# EAGLE design tiva-neural-signal-evk (EAGLE 6.6.0)
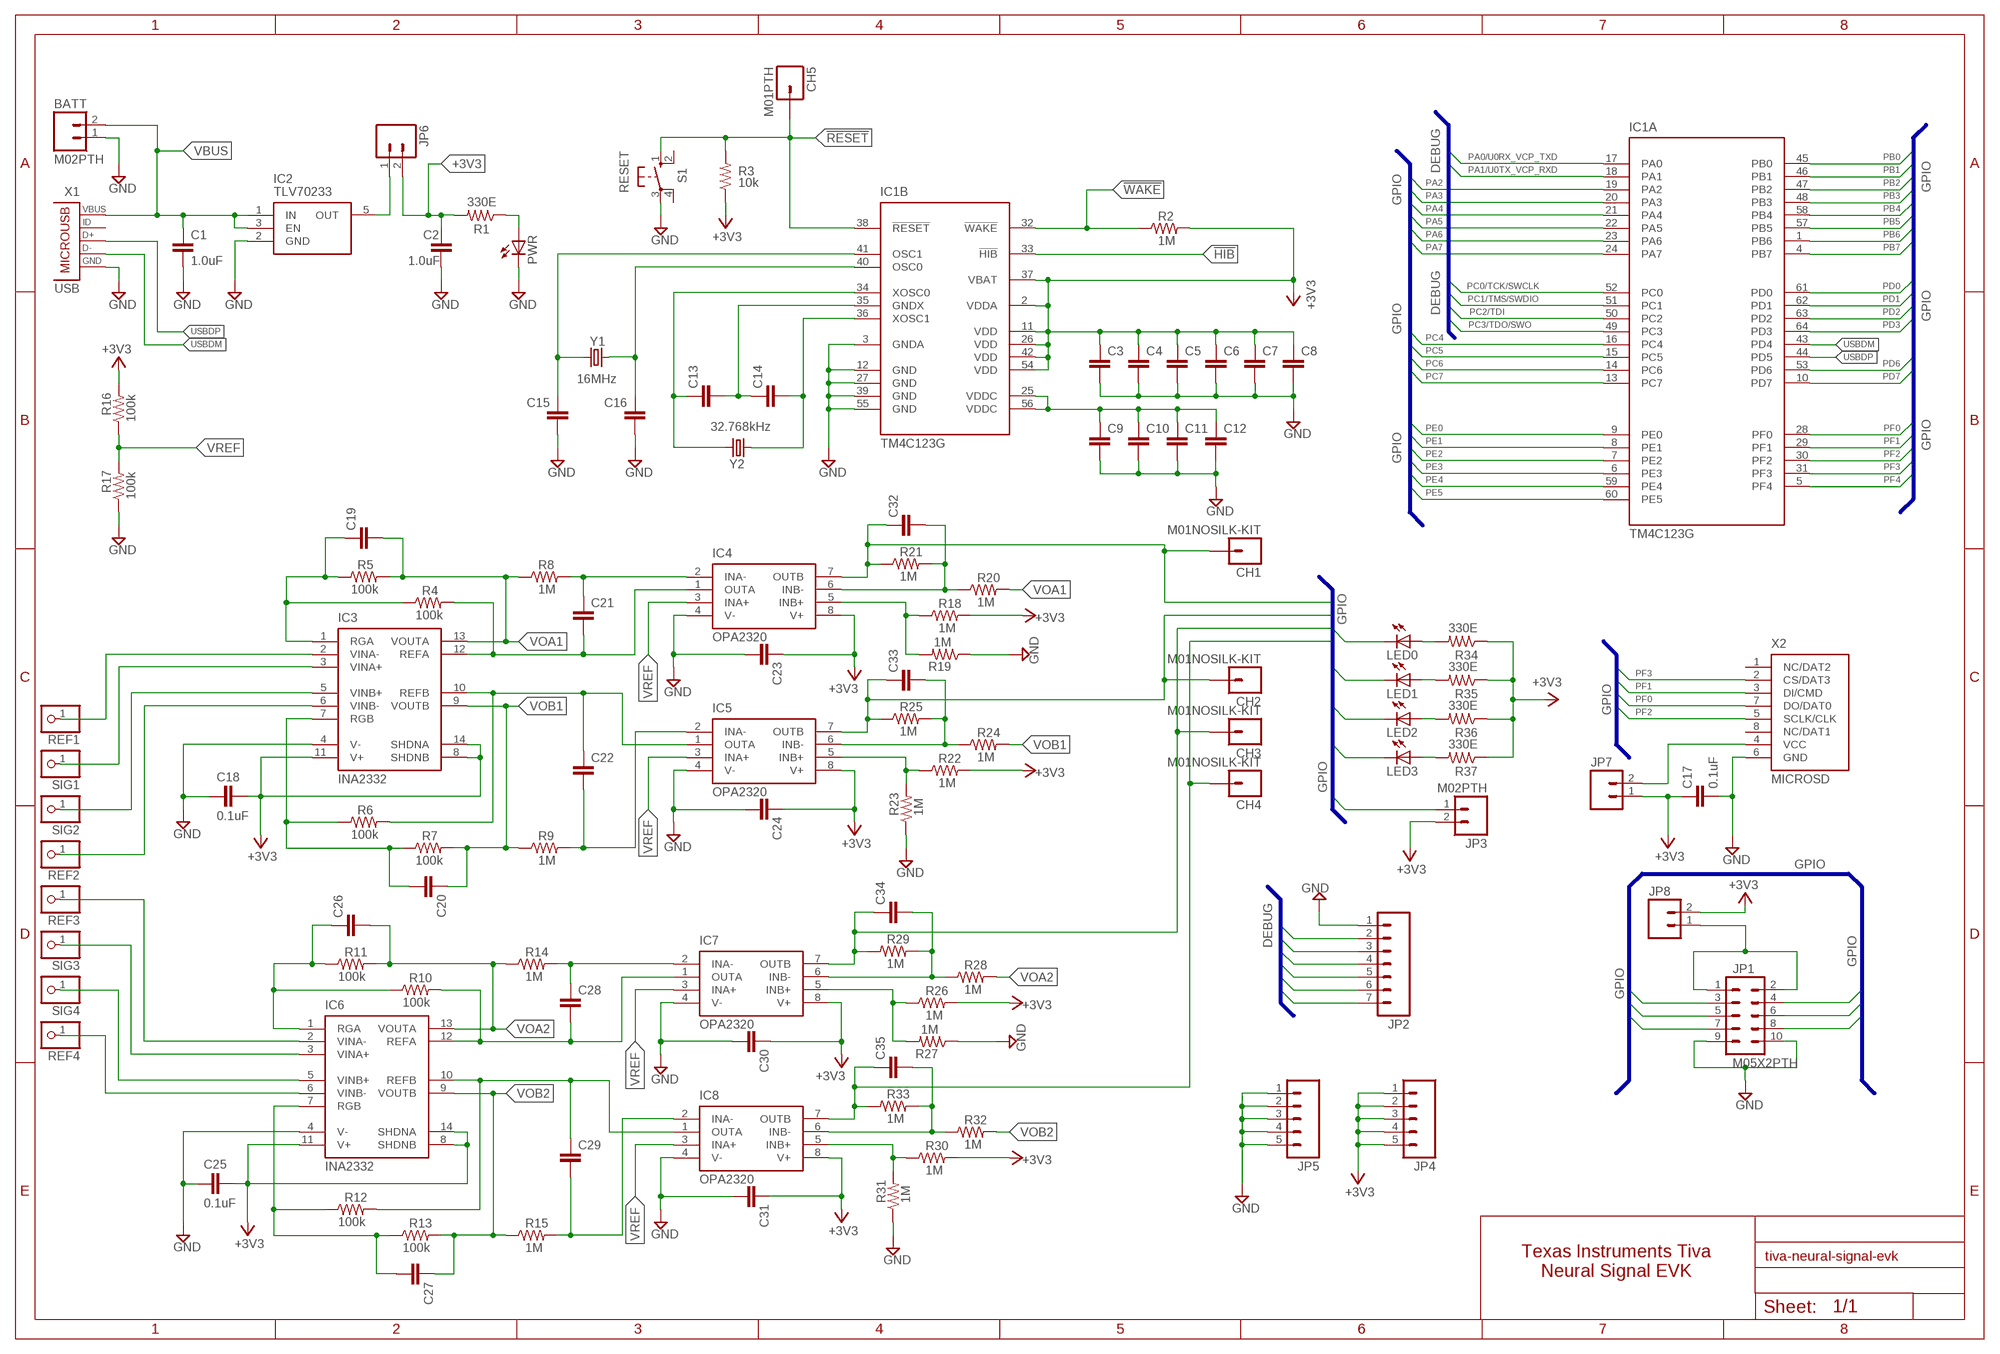
[diagram p0: schematic, sheet 1]

## Parts
BATT  M02PTH  [1X02]
C1  1.0uF  C-EUC0603  [C0603]
C2  1.0uF  C-EUC0603  [C0603]
C3  C-EUC0603  [C0603]
C4  C-EUC0603  [C0603]
C5  C-EUC0603  [C0603]
C6  C-EUC0603  [C0603]
C7  C-EUC0603  [C0603]
C8  C-EUC0603  [C0603]
C9  C-EUC0603  [C0603]
C10  C-EUC0603  [C0603]
C11  C-EUC0603  [C0603]
C12  C-EUC0603  [C0603]
C13  C-EUC0603  [C0603]
C14  C-EUC0603  [C0603]
C15  C-EUC0603  [C0603]
C16  C-EUC0603  [C0603]
C17  0.1uF  C-EUC0603  [C0603]
C18  0.1uF  C-EUC0603  [C0603]
C19  C-EUC0603  [C0603]
C20  C-EUC0603  [C0603]
C21  C-EUC0603  [C0603]
C22  C-EUC0603  [C0603]
C23  C-EUC0603  [C0603]
C24  C-EUC0603  [C0603]
C25  0.1uF  C-EUC0603  [C0603]
C26  C-EUC0603  [C0603]
C27  C-EUC0603  [C0603]
C28  C-EUC0603  [C0603]
C29  C-EUC0603  [C0603]
C30  C-EUC0603  [C0603]
C31  C-EUC0603  [C0603]
C32  C-EUC0603  [C0603]
C33  C-EUC0603  [C0603]
C34  C-EUC0603  [C0603]
C35  C-EUC0603  [C0603]
CH1  M01NOSILK-KIT  [1X01NS-KIT]
CH2  M01NOSILK-KIT  [1X01NS-KIT]
CH3  M01NOSILK-KIT  [1X01NS-KIT]
CH4  M01NOSILK-KIT  [1X01NS-KIT]
CH5  M01PTH  [1X01]
IC1  TM4C123G  [LQFP64]
IC2  TLV70233  [SOT23-5]
IC3  INA2332  [TSSOP14]
IC4  OPA2320  [MSOP08]
IC5  OPA2320  [MSOP08]
IC6  INA2332  [TSSOP14]
IC7  OPA2320  [MSOP08]
IC8  OPA2320  [MSOP08]
JP1  M05X2PTH  [AVR_ICSP]
JP2  M07  [1X07]
JP3  M02PTH  [1X02]
JP4  M05PTH  [1X05]
JP5  M05PTH  [1X05]
JP6  M021X02_NO_SILK  [1X02_NO_SILK]
JP7  M021X02_NO_SILK  [1X02_NO_SILK]
JP8  M021X02_NO_SILK  [1X02_NO_SILK]
LED0  LEDCHIP-LED0603  [CHIP-LED0603]
LED1  LEDCHIP-LED0603  [CHIP-LED0603]
LED2  LEDCHIP-LED0603  [CHIP-LED0603]
LED3  LEDCHIP-LED0603  [CHIP-LED0603]
PWR  LEDCHIP-LED0603  [CHIP-LED0603]
R1  330E  R-US_R0603  [R0603]
R2  1M  R-US_R0603  [R0603]
R3  10k  R-US_R0603  [R0603]
R4  100k  R-US_R0603  [R0603]
R5  100k  R-US_R0603  [R0603]
R6  100k  R-US_R0603  [R0603]
R7  100k  R-US_R0603  [R0603]
R8  1M  R-US_R0603  [R0603]
R9  1M  R-US_R0603  [R0603]
R10  100k  R-US_R0603  [R0603]
R11  100k  R-US_R0603  [R0603]
R12  100k  R-US_R0603  [R0603]
R13  100k  R-US_R0603  [R0603]
R14  1M  R-US_R0603  [R0603]
R15  1M  R-US_R0603  [R0603]
R16  100k  R-US_R0603  [R0603]
R17  100k  R-US_R0603  [R0603]
R18  1M  R-US_R0603  [R0603]
R19  1M  R-US_R0603  [R0603]
R20  1M  R-US_R0603  [R0603]
R21  1M  R-US_R0603  [R0603]
R22  1M  R-US_R0603  [R0603]
R23  1M  R-US_R0603  [R0603]
R24  1M  R-US_R0603  [R0603]
R25  1M  R-US_R0603  [R0603]
R26  1M  R-US_R0603  [R0603]
R27  1M  R-US_R0603  [R0603]
R28  1M  R-US_R0603  [R0603]
R29  1M  R-US_R0603  [R0603]
R30  1M  R-US_R0603  [R0603]
R31  1M  R-US_R0603  [R0603]
R32  1M  R-US_R0603  [R0603]
R33  1M  R-US_R0603  [R0603]
R34  330E  R-US_R0603  [R0603]
R35  330E  R-US_R0603  [R0603]
R36  330E  R-US_R0603  [R0603]
R37  330E  R-US_R0603  [R0603]
REF1  PINHD-1X1  [1X01]
REF2  PINHD-1X1  [1X01]
REF3  PINHD-1X1  [1X01]
REF4  PINHD-1X1  [1X01]
S1  RESET  10-XX  [B3F-10XX]
SIG1  PINHD-1X1  [1X01]
SIG2  PINHD-1X1  [1X01]
SIG3  PINHD-1X1  [1X01]
SIG4  PINHD-1X1  [1X01]
X1  USB  [USB-MICROB]
X2  MICROSD  [PUSH-PUSH]
Y1  16MHz  CRYSTAL5X3  [CRYSTAL-SMD-5X3]
Y2  32.768kHz  CRYSTAL32-SMD  [CRYSTAL-32KHZ-SMD]

## Nets
!HIB!: IC1.33(!HIB!)
!RESET!: CH5.1 IC1.38(!RESET!) R3.2 S1.1(S)
!WAKE!: IC1.32(!WAKE!) R2.1
+3V3 [power]: C2.1 C3.1 C4.1 C5.1 C6.1 C7.1 C8.1 C17.1 C18.1 C23.1 C24.1 C25.1 C30.1 C31.1 IC1.2(VDDA) IC1.11(VDD) IC1.26(VDD) IC1.37(VBAT) IC1.42(VDD) IC1.54(VDD) IC3.8(SHDNB) IC3.11(V+) IC3.14(SHDNA) IC4.8(V+) IC5.8(V+) IC6.8(SHDNB) IC6.11(V+) IC6.14(SHDNA) IC7.8(V+) IC8.8(V+) JP3.2 JP4.1 JP4.2 JP4.3 JP4.4 JP4.5 JP6.2 JP7.1 JP8.2 R1.2 R2.2 R3.1 R16.2 R18.2 R22.2 R26.2 R30.2 R34.1 R35.1 R36.1 R37.1
GND [power]: BATT.1 C1.2 C2.2 C3.2 C4.2 C5.2 C6.2 C7.2 C8.2 C9.2 C10.2 C11.2 C12.2 C15.2 C16.2 C17.2 C18.2 C23.2 C24.2 C25.2 C30.2 C31.2 IC1.3(GNDA) IC1.12(GND) IC1.27(GND) IC1.39(GND) IC1.55(GND) IC2.2(GND) IC3.4(V-) IC4.4(V-) IC5.4(V-) IC6.4(V-) IC7.4(V-) IC8.4(V-) JP1.9 JP1.10 JP2.1 JP5.1 JP5.2 JP5.3 JP5.4 JP5.5 PWR.C R17.1 R19.1 R23.1 R27.1 R31.1 S1.3(P) X1.GND X2.6(GND)
N$1: C20.2 IC3.7(RGB) R6.1 R7.1
N$2: C22.1 IC3.10(REFB) IC5.1(OUTA) R6.2
N$3: C26.1 IC6.1(RGA) R10.1 R11.1
N$4: C19.1 IC3.1(RGA) R4.1 R5.1
N$5: C21.2 IC3.12(REFA) IC4.1(OUTA) R4.2
N$6: C14.2 IC1.36(XOSC1) Y2.X1
N$7: C13.2 C14.1 IC1.35(GNDX)
N$8: C13.1 IC1.34(XOSC0) Y2.X2
N$9: C16.1 IC1.40(OSC0) Y1.3
N$10: C15.1 IC1.41(OSC1) Y1.1
N$11: PWR.A R1.1
N$12: C28.2 IC6.12(REFA) IC7.1(OUTA) R10.2
N$13: C27.2 IC6.7(RGB) R12.1 R13.1
N$14: C21.1 IC4.2(INA-) R8.2
N$15: C22.2 IC5.2(INA-) R9.2
N$16: C29.1 IC6.10(REFB) IC8.1(OUTA) R12.2
N$17: C28.1 IC7.2(INA-) R14.2
N$18: C29.2 IC8.2(INA-) R15.2
N$19: IC4.5(INB+) R18.1 R19.2
N$20: C32.2 IC4.6(INB-) R20.1 R21.2
N$21: IC3.2(VINA-) REF1.1
N$22: IC7.5(INB+) R26.1 R27.2
N$23: IC5.5(INB+) R22.1 R23.2
N$24: C33.2 IC5.6(INB-) R24.1 R25.2
N$25: IC3.3(VINA+) SIG1.1
N$26: C34.2 IC7.6(INB-) R28.1 R29.2
N$27: IC6.6(VINB-) REF4.1
N$28: IC8.5(INB+) R30.1 R31.2
N$29: C35.2 IC8.6(INB-) R32.1 R33.2
N$30: IC6.5(VINB+) SIG4.1
N$31: LED0.A R34.2
N$32: IC3.6(VINB-) REF2.1
N$33: IC6.2(VINA-) REF3.1
N$34: IC6.3(VINA+) SIG3.1
N$35: LED1.A R35.2
N$36: LED2.A R36.2
N$37: LED3.A R37.2
N$38: IC2.5(OUT) JP6.1
N$40 [power]: JP7.2 X2.4(VCC)
N$41 [power]: JP1.1 JP1.2 JP8.1
PA0: IC1.17(PA0) JP2.2
PA1: IC1.18(PA1) JP2.3
PA2: IC1.19(PA2)
PA3: IC1.20(PA3)
PA4: IC1.21(PA4)
PA5: IC1.22(PA5)
PA6: IC1.23(PA6)
PA7: IC1.24(PA7)
PB0: IC1.45(PB0) LED0.C
PB1: IC1.46(PB1) LED1.C
PB2: IC1.47(PB2) LED2.C
PB3: IC1.48(PB3) LED3.C
PB4: IC1.58(PB4)
PB5: IC1.57(PB5)
PB6: IC1.1(PB6) JP1.3
PB7: IC1.4(PB7) JP1.8
PC0: IC1.52(PC0) JP2.4
PC1: IC1.51(PC1) JP2.5
PC2: IC1.50(PC2) JP2.6
PC3: IC1.49(PC3) JP2.7
PC4: IC1.16(PC4)
PC5: IC1.15(PC5)
PC6: IC1.14(PC6)
PC7: IC1.13(PC7)
PD0: IC1.61(PD0) JP1.5
PD1: IC1.62(PD1) JP1.4
PD2: IC1.63(PD2) JP1.7
PD3: IC1.64(PD3) JP1.6
PD6: IC1.53(PD6)
PD7: IC1.10(PD7)
PE0: C35.1 CH4.1 IC1.9(PE0) IC8.7(OUTB) R33.1
PE1: C34.1 CH3.1 IC1.8(PE1) IC7.7(OUTB) R29.1
PE2: C33.1 CH2.1 IC1.7(PE2) IC5.7(OUTB) R25.1
PE3: C32.1 CH1.1 IC1.6(PE3) IC4.7(OUTB) R21.1
PE4: IC1.59(PE4)
PE5: IC1.60(PE5)
PF0: IC1.28(PF0) X2.7(DO/DAT0)
PF1: IC1.29(PF1) X2.3(DI/CMD)
PF2: IC1.30(PF2) X2.5(SCLK/CLK)
PF3: IC1.31(PF3) JP3.1 X2.2(CS/DAT3)
PF4: IC1.5(PF4)
SIG2: IC3.5(VINB+) SIG2.1
USBDM: IC1.43(PD4) X1.D-
USBDP: IC1.44(PD5) X1.D+
VBUS [power]: BATT.2 C1.1 IC2.1(IN) IC2.3(EN) X1.VBUS
VDDC: C9.1 C10.1 C11.1 C12.1 IC1.25(VDDC) IC1.56(VDDC)
VOA1: C19.2 IC3.13(VOUTA) R5.2 R8.1 R20.2
VOA2: C26.2 IC6.13(VOUTA) R11.2 R14.1 R28.2
VOB1: C20.1 IC3.9(VOUTB) R7.2 R9.1 R24.2
VOB2: C27.1 IC6.9(VOUTB) R13.2 R15.1 R32.2
VREF: IC4.3(INA+) IC5.3(INA+) IC7.3(INA+) IC8.3(INA+) R16.1 R17.2
Unconnected: S1.2(S1) S1.4(P1) X1.ID X2.1(NC/DAT2) X2.8(NC/DAT1)

## Buses
PA0,PA1,PC0,PC1,PC2,PC3
PA2,PA3,PA4,PA5,PA6,PA7,PC4,PC5,PC6,PC7,PE0,PE1,PE2,PE3,PE4,PE5,PB0,PB1,PB2,PB3,PB4,PB5,PB6,PB7,PD0,PD1,PD2,PD3,PD6,PD7,PF0,PF1,PF2,PF3,PF4

## Notes on the sheet
- DEBUG
- PA0/U0RX_VCP_TXD
- PA1/U0TX_VCP_RXD
- GPIO
- GPIO
- PC0/TCK/SWCLK
- DEBUG
- PC1/TMS/SWDIO
- GPIO
- PC2/TDI
- GPIO
- PC3/TDO/SWO
- GPIO
- GPIO
- GPIO
- GPIO
- GPIO
- GPIO
- DEBUG
- GPIO
- GPIO
- Texas Instruments Tiva
  Neural Signal EVK

## Library data of the parts
BATT JP3 JP6-JP8 = SparkFun-Connectors:M02: Standard 2-pin 0.1" header. Use with - straight break away headers ( PRT-00116) - right angle break away headers (PRT-00553) - swiss pins (PRT-00743) - machine pins (PRT-00117) - female headers (PRT-00115) Molex polarized connector foot print use with: PRT-08233 with associated crimp pins and housings. 2.54_SCREWTERM for use with PRT-10571. 3.5mm Screw Terminal footprints for PRT-08084 5mm Screw Terminal footprints for use with PRT-08433
C1 C2 = resistor:C-EU: CAPACITOR, European symbol
C3-C35 = rcl:C-EU: CAPACITOR, European symbol
CH1-CH5 = SparkFun-Connectors:M01: Header 1 Standard 1-pin 0.1" header. Use with straight break away headers (SKU : PRT-00116), right angle break away headers (PRT-00553), swiss pins (PRT-00743), machine pins (PRT-00117), and female headers (PRT-00115).
IC1 = mor307:TM4C123G: Texas Instruments Tiva TM4C123G ARM Cortex-M4 Microcontroller
IC2 = mor307:TLV70233: Texas Instruments TLV702xx 300mA Low-Droput Regulator
IC3 IC6 = mor307:INA2332: Texas Instruments INA2332 Low-Power, Single Supply Instrumentation Amplfiier
IC4 IC5 IC7 IC8 = mor307:OPA2320: Texas Instruments INA2332 Low-Power, Single Supply, CMOS Instrumentation Amplifier
JP1 = SparkFun-Connectors:M05X2: Header 5x2 Standard 10-pin dual row 0.1" header. Commonly used with AVR-ISP. Use with Spark Fun Electronics SKU: PRT-00778
JP2 = SparkFun-Connectors:M07: Header 7 Standard 7-pin 0.1" header. Use with straight break away headers (SKU : PRT-00116), right angle break away headers (PRT-00553), swiss pins (PRT-00743), machine pins (PRT-00117), and female headers (PRT-00115). NOTES ON THE VARIANTS LOCK and LOCK_LONGPADS... This footprint was designed to help hold the alignment of a through-hole component (i.e. 7-pin header) while soldering it into place. You may notice that each hole has been shifted either up or down by 0.005 of an inch from it's more standard position (which is usually a perfectly straight line). This slight alteration caused the pins (the squares in the middle) to touch the edges of the holes. Because they are alternating, it causes a "brace" to hold the header in place. 0.005 has proven to be the perfect amount of "off-center" position when using our standard breakaway headers. Although looks a little odd when you look at the bare footprint, once you have a header in there, the alteration is very hard to notice. Also, if you push a header all the way into place, it is covered up entirely on the bottom side. This idea of altering the position of holes to aid alignment will be further integrated into the Sparkfun Library for other footprints. It can help hold any component with 3 or more connection pins.
JP4 JP5 = SparkFun-Connectors:M05: Header 5 Standard 5-pin 0.1" header. Use with straight break away headers (SKU : PRT-00116), right angle break away headers (PRT-00553), swiss pins (PRT-00743), machine pins (PRT-00117), and female headers (PRT-00115). Molex polarized connector foot print use with SKU : PRT-08230 with associated crimp pins and housings.
LED0 LED1-LED3 PWR = led:LED: LED OSRAM: - CHIPLED LG R971, LG N971, LY N971, LG Q971, LY Q971, LO R971, LY R971 LH N974, LH R974 LS Q976, LO Q976, LY Q976 LO Q996 - Hyper CHIPLED LW Q18S LB Q993, LB Q99A, LB R99A - SideLED LS A670, LO A670, LY A670, LG A670, LP A670 LB A673, LV A673, LT A673, LW A673 LH A674 LY A675 LS A676, LA A676, LO A676, LY A676, LW A676 LS A679, LY A679, LG A679 - Hyper Micro SIDELED® LS Y876, LA Y876, LO Y876, LY Y876 LT Y87S - SmartLED LW L88C, LW L88S LB L89C, LB L89S, LG L890 LS L89K, LO L89K, LY L89K LS L896, LA L896, LO L896, LY L896 - TOPLED LS T670, LO T670, LY T670, LG T670, LP T670 LSG T670, LSP T670, LSY T670, LOP T670, LYG T670 LG T671, LOG T671, LSG T671 LB T673, LV T673, LT T673, LW T673 LH T674 LS T676, LA T676, LO T676, LY T676, LB T676, LH T676, LSB T676, LW T676 LB T67C, LV T67C, LT T67C, LS T67K, LO T67K, LY T67K, LW E67C LS E67B, LA E67B, LO E67B, LY E67B, LB E67C, LV E67C, LT E67C LW T67C LS T679, LY T679, LG T679 LS T770, LO T770, LY T770, LG T770, LP T770 LB T773, LV T773, LT T773, LW T773 LH T774 LS E675, LA E675, LY E675, LS T675 LS T776, LA T776, LO T776, LY T776, LB T776 LHGB T686 LT T68C, LB T68C - Hyper Mini TOPLED® LB M676 - Mini TOPLED Santana® LG M470 LS M47K, LO M47K, LY M47K Source: http://www.osram.convergy.de LUXEON: - LUMILED® LXK2-PW12-R00, LXK2-PW12-S00, LXK2-PW14-U00, LXK2-PW14-V00 LXK2-PM12-R00, LXK2-PM12-S00, LXK2-PM14-U00 LXK2-PE12-Q00, LXK2-PE12-R00, LXK2-PE12-S00, LXK2-PE14-T00, LXK2-PE14-U00 LXK2-PB12-K00, LXK2-PB12-L00, LXK2-PB12-M00, LXK2-PB14-N00, LXK2-PB14-P00, LXK2-PB14-Q00 LXK2-PR12-L00, LXK2-PR12-M00, LXK2-PR14-Q00, LXK2-PR14-R00 LXK2-PD12-Q00, LXK2-PD12-R00, LXK2-PD12-S00 LXK2-PH12-R00, LXK2-PH12-S00 LXK2-PL12-P00, LXK2-PL12-Q00, LXK2-PL12-R00 Source: www.luxeon.com KINGBRIGHT: KA-3528ASYC Source: www.kingbright.com
R1-R37 = rcl:R-US_: RESISTOR, American symbol
REF1-REF4 SIG1-SIG4 = pinhead:PINHD-1X1: PIN HEADER
S1 = CEDTv82:10-XX: OMRON SWITCH
X1 = mor307:USB: Micro USB B-type connector Digikey Part Number:609-4613-1-ND Manufacturer: FCI
X2 = mor307:MICROSD: Amphenol Micro SD Push-Push Type Connector Part No: - 114-00841-68-1-ND
Y1 = SparkFun-FreqCtrl:CRYSTAL: Various standard crystals. Proven footprints. Spark Fun Electronics SKU : COM-00534
Y2 = SparkFun-FreqCtrl:CRYSTAL: Various standard crystals. Proven footprints. Spark Fun Electronics SKU : COM-00534; PROD_ID: XTAL-07894

## Net classes
1 power: width 0.254 mm

## Board
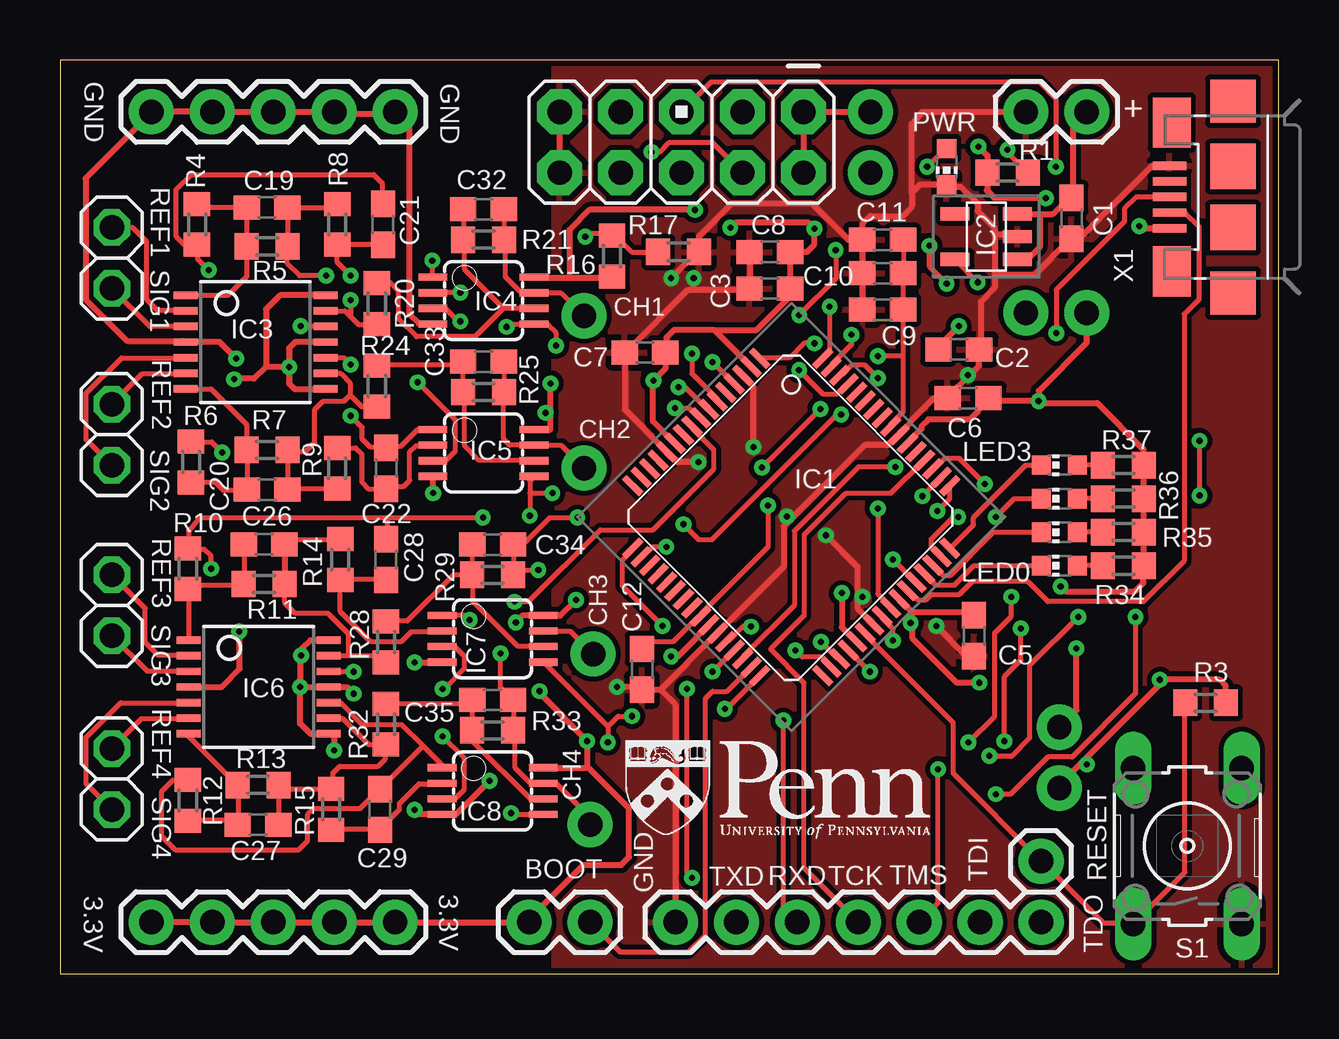
[diagram p1: board, top side]
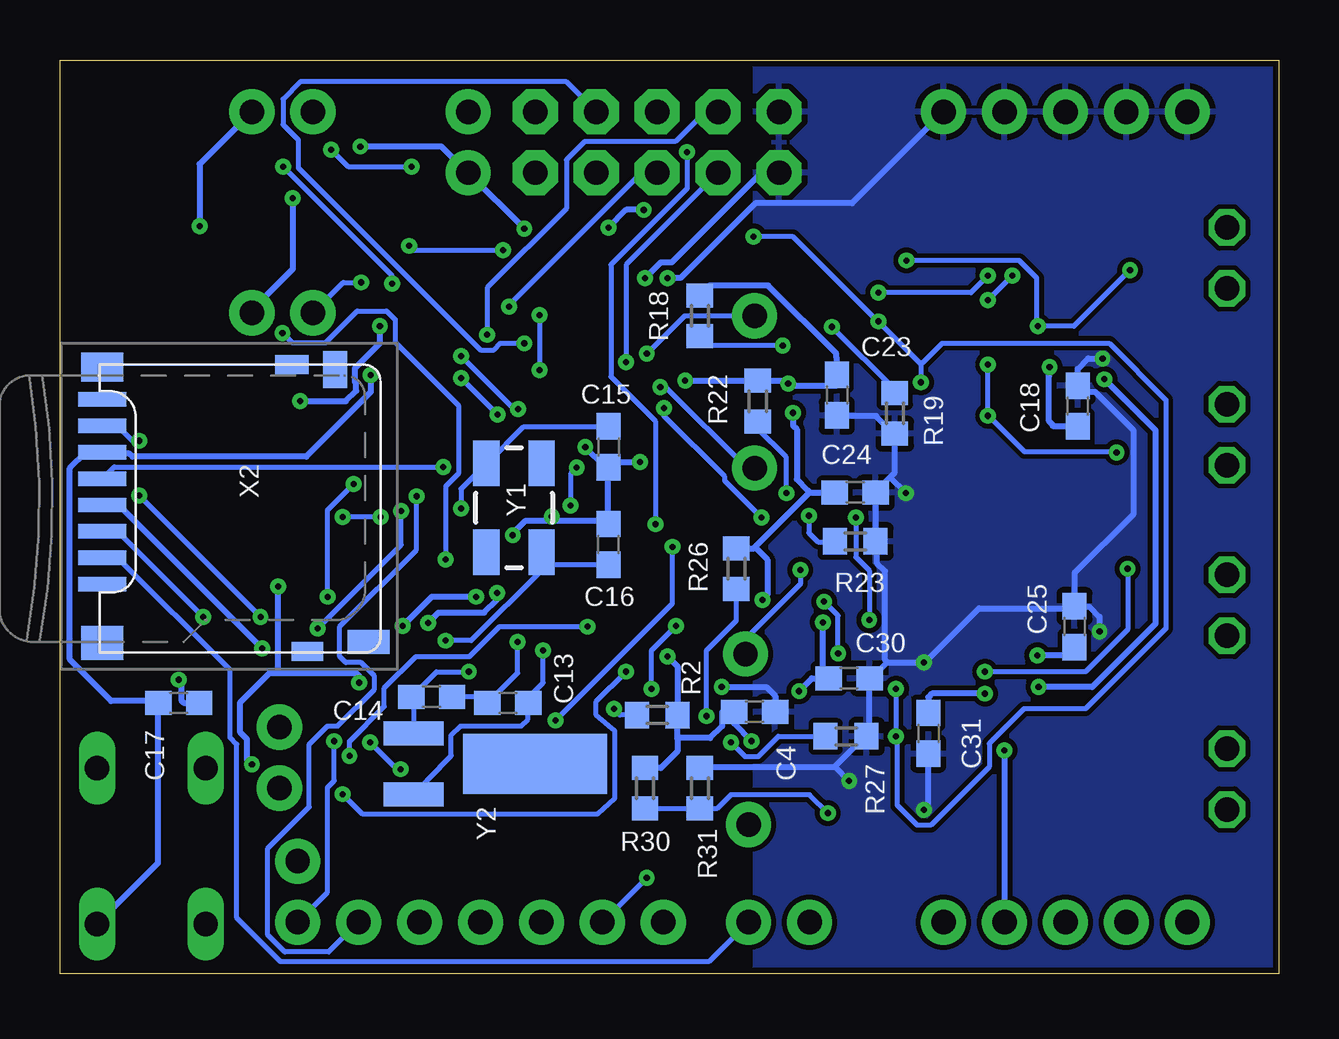
[diagram p2: board, bottom side, seen from below]

Size 50.8 x 38.1 mm. Coordinates in mm from the lower left corner, seen from the top.
Outline: 0,0 50.8,0 50.8,38.1 0,38.1 0,0
Copper layers (1*16): Top 0.035mm / dielectric 1.5mm / Bottom 0.035mm
Design rules "advancedcircuits": minimum track width 8mil, minimum drill 10mil, track to track 8mil, track to pad 8mil, pad to pad 8mil, via to via 8mil, smd to smd 8mil, copper to edge 10mil, drill to drill 8mil, minimum pad ring 10mil, minimum via ring 8mil, stop-mask expansion 4mil, vias tented up to drill 0mil, thermal gap 10mil

### Footprints (pad centres in the part's own frame; a part is rotated, then mirrored left to right if it is on the bottom)
1X02 = drill 1.016 pad 1.88: 1 0,0; 2 2.54,0
C0603 = smd 1.1 x 1: 1 -0.85,0; 2 0.85,0
1X01NS-KIT = drill 1.016 pad 1.88: 1 0,0
1X01 = drill 1.016 pad 1.88: 1 0,0
LQFP64 = smd 1 x 0.27: 1 -5.6,3.75; 2 -5.6,3.25; 3 -5.6,2.75; 4 -5.6,2.25; 5 -5.6,1.75; 6 -5.6,1.25; 7 -5.6,0.75; 8 -5.6,0.25; 9 -5.6,-0.25; 10 -5.6,-0.75; 11 -5.6,-1.25; 12 -5.6,-1.75; 13 -5.6,-2.25; 14 -5.6,-2.75; 15 -5.6,-3.25; 16 -5.6,-3.75; 33 5.6,-3.75; 34 5.6,-3.25; 35 5.6,-2.75; 36 5.6,-2.25; 37 5.6,-1.75; 38 5.6,-1.25; 39 5.6,-0.75; 40 5.6,-0.25; 41 5.6,0.25; 42 5.6,0.75; 43 5.6,1.25; 44 5.6,1.75; 45 5.6,2.25; 46 5.6,2.75; 47 5.6,3.25; 48 5.6,3.75 | smd 0.27 x 1: 17 -3.75,-5.6; 18 -3.25,-5.6; 19 -2.75,-5.6; 20 -2.25,-5.6; 21 -1.75,-5.6; 22 -1.25,-5.6; 23 -0.75,-5.6; 24 -0.25,-5.6; 25 0.25,-5.6; 26 0.75,-5.6; 27 1.25,-5.6; 28 1.75,-5.6; 29 2.25,-5.6; 30 2.75,-5.6; 31 3.25,-5.6; 32 3.75,-5.6; 49 3.75,5.6; 50 3.25,5.6; 51 2.75,5.6; 52 2.25,5.6; 53 1.75,5.6; 54 1.25,5.6; 55 0.75,5.6; 56 0.25,5.6; 57 -0.25,5.6; 58 -0.75,5.6; 59 -1.25,5.6; 60 -1.75,5.6; 61 -2.25,5.6; 62 -2.75,5.6; 63 -3.25,5.6; 64 -3.75,5.6
SOT23-5 = smd 0.55 x 1.2: 1 -0.95,-1.3; 2 0,-1.3; 3 0.95,-1.3; 4 0.95,1.3; 5 -0.95,1.3
TSSOP14 = smd 0.305 x 0.991: 1 -1.95,-2.918; 2 -1.3,-2.918; 3 -0.65,-2.918; 4 0,-2.918; 5 0.65,-2.918; 6 1.3,-2.918; 7 1.95,-2.918; 8 1.95,2.918; 9 1.3,2.918; 10 0.65,2.918; 11 0,2.918; 12 -0.65,2.918; 13 -1.3,2.918; 14 -1.95,2.918
MSOP08 = smd 1.2 x 0.3: 1 -2.113,0.976; 2 -2.113,0.326; 3 -2.113,-0.324; 4 -2.113,-0.974; 5 2.112,-0.974; 6 2.112,-0.324; 7 2.112,0.326; 8 2.112,0.976
AVR_ICSP = drill 1.016 pad 1.88 octagon: 1 -1.27,5.08; 2 1.27,5.08; 3 -1.27,2.54; 4 1.27,2.54; 5 -1.27,0; 6 1.27,0; 7 -1.27,-2.54; 8 1.27,-2.54; 9 -1.27,-5.08; 10 1.27,-5.08
1X07 = drill 1.016 pad 1.88: 1 0,0; 2 2.54,0; 3 5.08,0; 4 7.62,0; 5 10.16,0; 6 12.7,0; 7 15.24,0
1X05 = drill 1.016 pad 1.88: 1 0,0; 2 2.54,0; 3 5.08,0; 4 7.62,0; 5 10.16,0
1X02_NO_SILK = drill 1.016 pad 1.88: 1 0,0; 2 2.54,0
CHIP-LED0603 = smd 0.8 x 0.8: A 0,-0.75; C 0,0.75
R0603 = smd 1 x 1.1: 1 -0.85,0; 2 0.85,0
1X01' = drill 1.016 octagon: 1 0,0
B3F-10XX = drill 1.016 long: 1 -3.251,2.261; 2 3.251,2.261; 3 -3.251,-2.261; 4 3.251,-2.261
USB-MICROB = smd 0.35 x 1.4: D+ 0,2.65; D- -0.65,2.65; GND 1.3,2.65; ID 0.65,2.65; VBUS -1.3,2.65 | smd 1.8 x 1.9: MT1 -4,0; MT2 4,0 | smd 1.9 x 1.9: P$1 -1.27,0; P$2 1.27,0 | smd 2.1 x 1.6: P$3 -3.1,2.55; P$4 3.1,2.55
PUSH-PUSH = smd 0.6 x 2: 1 9.15,4.3; 2 8.05,4.3; 3 6.95,4.3; 4 5.85,4.3; 5 4.75,4.3; 6 3.65,4.3; 7 2.55,4.3; 8 1.45,4.3 | smd 1.2 x 1.75: C1 0.1,4.3 | smd 1.4 x 1.75: C2 11.6,4.3 | smd 1 x 1.75: CD1 11.55,15.4 | smd 1.55 x 1: CD2 0.2,14 | smd 0.8 x 1.4: GND2 0,12.2 | smd 0.8 x 1.3: GND3 11.95,12.85
CRYSTAL-SMD-5X3 = smd 1.9 x 1.1: 1 -1.85,-1.15; 2 1.85,-1.15; 3 1.85,1.15; 4 -1.85,1.15
CRYSTAL-32KHZ-SMD = smd 2.5 x 6: SHEILD 0,5.08 | smd 1 x 2.5: X1 -1.27,0; X2 1.27,0

### Placement (x,y rotation side)
BATT  40.26,35.94 0 top
C1  42.16,31.5 270 top
C2  37.47,26.04 0 top
C3  29.59,28.57 180 top
C4  21.84,10.92 0 bottom
C5  38.1,14.1 270 top
C6  37.85,24 180 top
C7  24.38,25.91 180 top
C8  29.59,30.1 180 top
C9  34.29,27.69 180 top
C10  34.29,29.21 180 top
C11  34.29,30.61 180 top
C12  24.26,12.7 270 top
C13  32.13,11.3 180 bottom
C14  35.31,11.56 180 bottom
C15  27.94,21.97 270 bottom
C16  27.94,17.91 90 bottom
C17  45.85,11.3 180 bottom
C18  8.38,23.67 90 bottom
C19  8.64,31.95 0 top
C20  8.64,20.19 180 top
C21  13.46,31.24 90 top
C22  13.59,21.08 270 top
C23  18.41,24.13 270 bottom
C24  17.65,20.07 0 bottom
C25  8.51,14.48 90 bottom
C26  8.51,17.91 0 top
C27  8.26,6.22 180 top
C28  13.59,17.27 90 top
C29  13.34,6.86 270 top
C30  17.91,12.32 0 bottom
C31  14.61,10.03 270 bottom
C32  17.65,31.88 180 top
C33  17.65,25.53 180 top
C34  18.03,17.91 180 top
C35  18.03,11.43 180 top
CH1  21.84,27.43 0 top
CH2  21.84,21.08 0 top
CH3  22.23,13.34 0 top
CH4  22.1,6.22 0 top
CH5  40.89,4.7 0 top
IC1  30.48,19.05 315 top
IC2  38.61,30.73 90 top
IC3  8.15,26.34 270 top
IC4  17.65,28.07 0 top
IC5  17.65,21.72 0 top
IC6  8.28,11.96 270 top
IC7  18.03,13.97 0 top
IC8  18.03,7.62 0 top
JP1  25.91,34.67 270 top
JP2  25.65,2.16 0 top
JP3  22.1,2.16 180 top
JP4  3.81,2.16 0 top
JP5  3.81,35.94 0 top
JP6  40.26,27.56 0 top
JP7  41.66,7.75 90 top
JP8  33.78,35.94 270 top
LED0  41.66,17.02 90 top
LED1  41.66,18.41 90 top
LED2  41.66,19.81 90 top
LED3  41.66,21.21 90 top
PWR  36.96,33.66 180 top
R1  39.5,33.4 180 top
R2  25.91,10.79 0 bottom
R3  47.75,11.3 180 top
R4  5.71,31.24 270 top
R5  8.64,30.33 0 top
R6  5.46,21.34 90 top
R7  8.64,21.84 0 top
R8  11.56,31.24 270 top
R9  11.56,21.08 90 top
R10  5.33,16.89 90 top
R11  8.51,16.26 0 top
R12  5.33,7.24 90 top
R13  8.26,7.87 0 top
R14  11.68,17.27 270 top
R15  11.3,6.86 270 top
R16  23.01,29.92 270 top
R17  25.78,30.1 180 top
R18  24.13,27.43 90 bottom
R19  16,23.37 90 bottom
R20  13.21,27.94 270 top
R21  17.65,30.61 180 top
R22  21.72,23.88 90 bottom
R23  17.65,18.03 180 bottom
R24  13.21,24.51 270 top
R25  17.65,24.26 180 top
R26  22.61,16.89 90 bottom
R27  18.03,9.91 180 bottom
R28  13.59,13.84 270 top
R29  18.03,16.64 180 top
R30  26.42,7.75 90 bottom
R31  24.13,7.75 270 bottom
R32  13.59,10.41 270 top
R33  18.03,10.16 180 top
R34  44.32,17.02 180 top
R35  44.32,18.41 180 top
R36  44.32,19.81 180 top
R37  44.32,21.21 180 top
REF1  [1X01']  2.16,31.11 0 top
REF2  [1X01']  2.16,23.75 0 top
REF3  [1X01']  2.16,16.64 0 top
REF4  [1X01']  2.16,9.4 0 top
S1  46.99,5.33 90 top
SIG1  [1X01']  2.16,28.57 0 top
SIG2  [1X01']  2.16,21.21 0 top
SIG3  [1X01']  2.16,14.1 0 top
SIG4  [1X01']  2.16,6.86 0 top
U$1  [PENNLOGO]  23.57,5.64 0 top
X1  48.9,32.38 90 top
X2  53.34,25.4 270 bottom
Y1  31.88,19.43 270 bottom
Y2  36.07,8.76 270 bottom

### Tracks (layer width: path | path; a pad name or v marks a point on that pad's centre or on a via)
!RESET!
  Top 0.203: R3.2 46.89,11.3 46.89,4.24 S1.1 44.65,2.13 43.48,2.13 40.97,4.65 CH5.1 37.24,8.36 37.24,10.46 33.58,14.12 33.58,14.2 IC1.38
!WAKE!  (via drill 0.25)
  Top 0.203: 29.16,12.42 IC1.32 27.84,11.11 27.77,11.11 v27.71,11.05
  Bottom 0.203: R2.1 27.46,10.79 v27.71,11.05
+3V3  (via drill 0.25)
  Top 0.254: JP4.1 JP4.2 JP4.3 JP4.4 JP4.5 JP3.2 19.63,2.26 19.63,2.36 21.82,4.55 23.39,4.55 23.72,4.88 23.72,6.91 21.97,8.66 | 11.05,24.38 IC3.8 9.78,24.38 9.55,24.61 v9.55,25.3 | IC3.14 11.05,28.3 9.17,28.3 8.59,27.71 8.59,25.32 | IC6.14 11.18,13.92 10.44,13.92 10.06,13.54 v10.06,13.28 10.01,13.23 v10.01,11.96 | v11.43,9.32 11.43,10.01 11.33,10.01 IC6.8 11.18,10.01 10.44,10.01 10.01,10.44 v10.01,11.96 | IC1.54 35.33,22.15 35.92,22.73 35.92,22.84 36.2,23.11 37.92,23.11 38.28,23.47 38.28,24 C6.1 39.09,24 39.22,23.88 v40.79,23.88 | 37.36,26.9 v37.47,27 36.62,26.15 C2.1 | v40.79,23.88 40.89,23.8 43.23,23.8 45.16,21.87 45.16,21.31 R37.1 R36.1 45.16,19.71 45.16,18.52 R35.1 R34.1 45.16,16.92 45.16,16.31 44.81,15.95 41.91,15.95 v41.71,16.15 | JP6.2 42.8,26.31 40.79,24.31 v40.79,23.88 | v32.59,15.88 32.59,14.45 33.17,13.87 33.2,13.87 IC1.37 | 35.46,15.09 35.46,15.14 IC1.42 | 35.46,15.09 v35.46,14.63 35.53,14.53 35.53,13.99 37.39,12.14 v38.33,12.14 | R3.1 48.59,12.01 48.34,12.27 v45.85,12.27 45.77,12.17 45.77,11.99 42.66,8.88 | 42.66,8.88 41.66,7.87 JP7.1 | v42.8,8.74 42.66,8.88 | v25.48,13.23 25.76,13.23 26.54,14.02 26.54,14.07 27.03,14.55 IC1.26 | IC8.8 20.17,8.59 21.89,8.59 21.97,8.66 | v21.51,15.6 20.85,14.94 20.27,14.94 IC7.8 20.14,14.94 19.28,14.94 v19,14.66 | IC1.11 25.63,22.15 25.6,22.17 25.58,22.17 24.71,23.04 24.71,24.71 v24.74,24.74 25.23,25.23 C7.1 25.27,25.95 25.27,26.52 25.6,26.85 27.28,26.85 | 20.45,23.39 20.45,22.71 20.42,22.68 19.79,22.68 IC5.8 | 20.45,23.39 v20.45,24.61 | v20.24,23.39 20.45,23.39 | v19.99,11.79 19.99,11.71 21.89,9.8 v21.97,9.7 21.97,8.66
  Top 0.254: IC1.2 28.8,25.32 28.78,25.32 28.78,25.35 27.28,26.85 | 22.99,29.26 R16.2 22.97,29.03 21.23,29.03 | IC4.8 19.79,29.03 21.23,29.03 | v38.28,34.49 38.66,34.11 R1.2 38.66,33.3 38.66,32.69 38.63,32.66 38.94,32.36 40.87,32.36 40.89,32.33 v41.1,32.33 | 21.23,29.03 21.23,31.01 22.07,31.85 v26.47,31.85 | v27.94,31.11 28.14,31.32 31.22,31.32 31.37,31.17 v31.45,31.06 31.45,30.4 31.14,30.1 C8.1 C3.1 30.44,28.26 29.03,26.85 27.28,26.85 | v7.26,24.79 7.29,24.82 8.08,24.82 8.59,25.32 | IC3.11 9.8,26.34 9.55,26.09 v9.55,25.3 | 8.59,25.32 9.53,25.32 v9.55,25.3 | v10.01,11.96 IC6.11 11.96,11.96 v12.24,11.68 | 35.46,15.09 37.96,15.09 C5.1
  Bottom 0.254: C31.1 14.61,11.53 14.45,11.68 v12.24,11.68 | v11.43,9.32 JP4.4 | v37.47,27 37.47,26.29 38.51,25.25 38.51,24.69 38.46,24.64 38.46,24.31 38.89,23.88 v40.79,23.88 | v32.59,15.88 32.59,15.6 33.12,15.06 35.03,15.06 v35.46,14.63 | C17.1 45.64,11.3 45.74,11.4 45.74,12.17 v45.85,12.27 | v38.33,12.14 38.33,12.42 38.46,12.55 41.71,12.55 | 41.71,12.55 42.06,12.55 43.28,11.33 43.28,10.06 43,9.78 43,8.94 v42.8,8.74 | 41.71,12.55 v41.71,16.15 | R2.2 | 25.07,10.69 R2.2 | R30.2 26.42,8.59 25.76,8.59 25.07,9.27 25.07,9.8 25.04,9.83 | 19.56,20.07 C24.1 | 21.83,17.79 21.89,17.73 22.61,17.73 R26.2 | 21.83,17.79 19.56,20.07 | v21.51,15.6 21.31,15.8 21.31,17.27 21.83,17.79 | R18.2 23.71,28.7 21.29,28.7 18.44,25.86 18.44,25.7 18.41,25.68 C23.1 18.41,24.54 20.34,24.54 v20.45,24.61 20.55,24.71 21.72,24.71 R22.2 21.82,24.71 24.71,24.71 v24.74,24.74 | v20.24,23.39 20.24,22.86 20.09,22.71 20.09,20.62 19.63,20.17 19.56,20.07 | v19.99,11.79 19.46,12.32 19.2,12.32 | 19.2,12.32 C30.1 | v31.45,31.06 JP8.2 33.88,33.48 34.9,34.49 v38.28,34.49 | JP6.2 42.8,27.69 41.1,29.39 v41.1,32.33 | C18.1 9.39,22.82 9.42,22.86 9.42,22.89 9.58,23.04 9.58,24.92 v9.55,25.3 | v7.26,24.79 5.13,22.66 5.13,14.61 7.77,11.96 v10.01,11.96 | v26.47,31.85 27.2,31.85 v27.94,31.11 | C25.1 8.85,13.28 v10.06,13.28 | v21.97,9.7 22.69,10.43 C4.1 23.19,10.92 23.19,10.34 23.7,9.83 25.04,9.83 | 25.04,9.83 25.06,9.84 R2.2 | v25.48,13.23 25.06,12.81 R2.2 | 19.2,12.32 19,12.52 v19,14.66
GND  (via drill 0.25)
  Top 0.254: JP1.9 JP1.10 | C8.2 28.75,30.1 28.75,28.57 C3.2 28.63,28.52 26.42,28.52 | 25.3,21.77 IC1.12 | IC1.12 25.2,21.87 23.55,23.52 23.55,25.91 C7.2 23.65,25.98 26.19,28.52 26.42,28.52 | 26.42,28.52 v26.42,29.01 | v28.91,21.97 28.91,24.51 28.47,24.94 IC1.3 | IC1.39 33.83,14.66 33.25,15.24 33.25,15.72 | 33.25,15.72 33.25,16.97 v31.93,18.29 | v36.52,14.5 37.77,13.26 C5.2 | v33.45,15.72 33.25,15.72 | IC1.27 | 25.04,11.86 27.3,14.12 IC1.27 | 25.04,11.86 24.26,11.86 C12.2 24.18,11.96 v23.22,11.96 | JP2.1 25.65,11.23 25.12,11.76 25.04,11.86 | X1.GND 46.23,33.68 45.52,33.68 42.49,30.66 C1.2 42.06,30.58 40.64,29.16 38.96,29.16 | 34.95,22.48 IC1.55 | IC1.55 35.03,22.58 35.46,23.01 35.46,23.04 36.42,24 C6.2 37.06,24.11 37.88,24.93 | 37.88,24.93 38.3,25.35 38.3,26.04 C2.2 38.38,26.14 38.38,28.02 38.96,28.6 38.96,29.16 | C9.2 33.45,27.69 33.45,29.21 C10.2 33.45,29.31 33.45,30.5 C11.2 | IC2.2 39.8,30.81 38.96,30.81 | 36.96,32.89 PWR.C | C11.2 33.45,30.61 33.45,31.27 33.78,31.6 35.13,31.6 35.51,31.98 35.51,32.56 | PWR.C 37.06,32.82 37.54,32.82 38.25,32.11 38.25,31.8 38.96,31.09 38.96,30.81 | 38.96,30.81 38.96,29.16 | 30.44,18.94 33.55,22.05 34.49,22.05 34.85,22.4 IC1.55 | 30.44,18.94 30.18,18.67 30.18,16.99 27.48,14.3 IC1.27 | v30.3,19.07 30.44,18.94 | v37.85,24.97 37.88,24.93 | v26.62,21.34 25.76,21.34 25.4,21.69 IC1.12 | v7.34,25.65 6.66,26.34 IC3.4 5.13,26.39 2.79,26.39 1.07,28.12 1.07,33.17 3.73,35.84 JP5.1 JP5.2 JP5.3 JP5.4 11.53,35.87 13.87,35.87 JP5.5 14.55,35.36 14.55,27.51 14.96,27.1 15.52,27.1 IC4.4 | v15.54,20.04 15.54,20.73 IC5.4 | 15.9,6.66 IC8.4 | v14.78,12.98 15.9,12.98 IC7.4 | v17.91,8.05 16.51,6.66 16.05,6.66 IC8.4
  Top 0.254: 26.64,30.73 26.64,30.76 28.02,32.13 | 26.64,30.18 26.64,30.1 R17.1 26.52,30.05 v25.48,29.01 26.64,30.18 | IC6.4 6.73,11.96 7.49,12.72 7.49,14.25 v7.47,14.28 | IC8.4 15.77,6.66 14.96,6.66 v14.78,6.83 | BATT.1 35.97,35.94 35.51,35.43 35.51,32.56 | 31.32,32.13 31.34,32.13 32.61,30.86 | PWR.C 35.85,32.91 35.51,32.56 | 26.64,30.18 26.64,30.73 | 26.64,30.73 28.02,32.13 | 28.02,32.13 31.32,32.13 | 31.32,32.13 32.61,30.86 | 32.61,30.86 32.87,30.61 C11.2
  Bottom 0.254: JP1.10 21.57,33.4 25.3,29.67 25.76,29.67 v26.42,29.01 | S1.3 46.71,4.62 C17.2 46.81,11.38 48.67,11.38 50.39,13.11 50.39,21.08 49.73,21.74 X2.6 48.92,21.69 47.9,21.69 47.78,21.57 40.54,21.57 37.85,24.26 v37.85,24.97 | C15.2 27.94,21.13 28.07,21.13 v28.91,21.97 | v31.93,18.29 31.93,18.36 31.42,18.87 30.3,18.87 | 30.3,18.87 28.04,18.87 27.94,18.77 C16.2 27.96,18.97 27.96,21.01 C15.2 | v36.52,14.5 35.31,15.72 v33.45,15.72 | 21.16,10.92 C4.2 20.98,10.94 20.98,11.58 21.36,11.96 v23.22,11.96 | v30.3,19.07 30.3,18.87 | v26.62,21.34 27.96,21.34 C15.2 | C25.2 8.51,15.32 7.9,15.32 7.47,14.88 v7.47,14.28 | 8.46,15.67 8.46,15.44 C25.2 | 8.28,24.28 C18.2 | 16.2,20.7 16.74,20.17 C24.2 16.82,20.07 16.82,18.03 R23.1 16.74,17.93 16.74,17.12 16.41,16.79 16.41,13.08 16.33,12.98 | 16.2,20.7 16,20.9 R19.1 16.1,22.58 16.79,23.27 18.41,23.27 C23.2 | 16.2,20.7 v15.54,20.04 | C31.2 14.61,7.01 v14.78,6.83 | 18.5,8.65 17.3,9.86 R27.1 17.07,10.01 C30.2 16.94,12.37 16.33,12.98 | 18.5,8.65 18.54,8.61 24.13,8.61 R31.1 | 16.33,12.98 v14.78,12.98 14.68,13.06 12.5,15.24 8.61,15.24 C25.2 | 18.5,8.65 v17.91,8.05 | v25.48,29.01 24.94,29.01 21.82,32.13 17.78,32.13 JP5.5 | C18.2 8.38,25.22 7.95,25.65 v7.34,25.65 | C18.2 8.12,24.26 7.64,24.26 6.07,22.68 6.07,19.15 8.51,16.71 C25.2
  pour Bottom: 0.36,37.87 21.82,37.87 21.82,0.28 0.36,0.28
  pour Top: 20.62,37.87 50.6,37.87 50.6,0.18 20.62,0.18
N$1
  Top 0.203: 7.77,22.05 7.77,21.84 R7.1 | IC3.7 5.26,24.38 6.3,24.38 7.77,22.91 7.77,21.86 R7.1 | C20.2 7.8,21.77 R7.1 | R6.1 6.48,20.5 6.81,20.17 7.76,20.17 C20.2 | 7.72,20.5 C20.2
N$2  (via drill 0.25)
  Top 0.203: v12.12,25.4 11.84,25.68 11.07,25.68 IC3.10 | R6.2 5.46,22.17 6.33,22.17 v6.76,21.74 | 15.52,22.68 IC5.1 15.53,22.71 14.94,22.71 14.22,22 13.66,22 C22.1 13.59,21.95 12.95,21.95 12.6,22.3 12.6,22.78 v12.12,23.27
  Bottom 0.203: v12.12,25.4 v12.12,23.27 12.04,23.22 10.59,21.77 6.78,21.77 v6.76,21.74
N$3
  Top 0.203: C26.1 7.67,17.91 7.67,16.26 R11.1 7.57,16.2 5.51,16.2 5.41,16.1 R10.1 5.33,16.03 5.36,16 IC6.1
N$4
  Top 0.203: 7.77,30 7.77,30.73 R5.1 | IC3.1 5.26,28.3 7.01,28.3 7.8,29.08 7.8,30.32 R5.1 | 7.72,30.81 R5.1 | R5.1 C19.1 5.85,31.95 R4.1
N$5  (via drill 0.25)
  Top 0.203: v10.03,27 11.05,27 IC3.12 | 5.71,30.38 R4.2 | 13.46,32.11 C21.2 13.44,32.12 13.44,32.97 13.08,33.33 5.46,33.33 4.85,32.72 4.85,30.73 5.18,30.4 5.7,30.4 R4.2 | 5.66,30.48 R4.2 | v15.52,29.74 15.52,29.06 IC4.1 | v6.2,29.34 5.74,29.79 5.74,30.37 R4.2
  Bottom 0.203: v6.2,29.34 8.53,27 v10.03,27 10.08,27.08 10.08,29.01 10.82,29.74 v15.52,29.74
N$6  (via drill 0.25)
  Top 0.203: v33.76,12.6 32.87,13.49 IC1.36
  Bottom 0.203: v33.76,12.6 35.1,12.6 36.14,11.56 C14.2 36.07,11.51 Y2.X1
N$7  (via drill 0.25)
  Top 0.203: v31.73,13.84 32.41,13.16 32.49,13.16 IC1.35
  Bottom 0.203: v31.73,13.84 31.73,12.55 C13.2 32.84,11.56 C14.1
N$8  (via drill 0.25)
  Top 0.203: 32.16,12.7 32.16,12.78 | 32.16,12.78 IC1.34 | 32.16,12.78 32.16,12.8 31.75,13.21 30.94,13.21 v30.66,13.49
  Bottom 0.203: v30.66,13.49 30.66,12.14 31.5,11.3 C13.1 31.29,11.29 31.29,10.62 31.57,10.34 34.11,10.34 34.49,9.96 34.49,9.09 34.98,8.61 34.98,8.59 Y2.X2
N$9  (via drill 0.25)
  Top 0.203: v34.72,13.89 34.72,14.38 34.27,14.83 IC1.40
  Bottom 0.203: v34.72,13.89 33.66,13.89 30.73,16.82 Y1.3 30.66,17.07 C16.1
N$10  (via drill 0.25)
  Top 0.203: v34.09,19.41 34.09,15.85 34.59,15.34 34.59,15.29 IC1.41
  Bottom 0.203: v34.09,19.41 34.09,20.22 33.05,21.26 Y1.1 32.94,21.34 31.47,22.81 C15.1
N$11  (via drill 0.25)
  Top 0.203: v36.14,33.66 36.88,34.39 36.96,34.39 PWR.A | v39.5,34.37 39.5,34.24 40.34,33.4 R1.1
  Bottom 0.203: v36.14,33.66 38.79,33.66 v39.5,34.37
N$12  (via drill 0.25)
  Top 0.203: v12.24,12.6 11.2,12.6 IC6.12 | 5.33,17.73 R10.2 | 13.59,18.14 C28.2 | 5.71,17.48 R10.2 | v17.07,14.76 16.89,14.94 15.93,14.94 IC7.1 | C28.2 13.66,18.19 13.66,18.95 13.59,19.02 | R10.2 5.36,17.77 5.36,18.47 5.82,19.02 13.59,19.02 | v6.3,16.89 6.3,17.42 6.02,17.7 5.37,17.7 R10.2 | 13.56,18.15 C28.2 | 13.59,19.02 v17.63,19.02
  Bottom 0.203: v12.24,12.6 8.05,12.6 6.3,14.35 v6.3,16.89 | v17.07,14.76 17.07,16.82 17.63,17.37 v17.63,19.02
N$13
  Top 0.203: IC6.7 5.38,10.01 5.38,9.88 7.39,7.87 R13.1 7.42,7.8 C27.2 7.34,6.4 R12.1
N$14  (via drill 0.25)
  Top 0.203: 11.63,30.4 13.46,30.4 C21.1 | 11.63,30.4 11.56,30.4 | v16.69,28.4 IC4.2 | v12.12,29.11 11.56,29.67 R8.2 11.63,30.4
  Bottom 0.203: v16.69,28.4 12.83,28.4 v12.12,29.11
N$15
  Top 0.203: 15.52,22.02 IC5.2 15.52,22.02 | R9.2 12.33,21.93 12.57,21.69 12.57,20.5 12.85,20.22 13.57,20.22 C22.2 13.64,20.32 14.33,20.32 14.58,20.57 14.58,21.77 14.83,22.02 15.52,22.02
N$16
  Top 0.203: 15.13,9.51 15.9,8.74 15.9,8.61 IC8.1 | 15.13,9.51 14.25,10.39 12.62,10.39 11.71,11.3 IC6.10 | 15.13,9.51 13.34,7.72 C29.1 13.26,7.64 12.5,6.88 10.57,6.88 10.31,6.63 10.31,5.54 9.93,5.16 4.83,5.16 4.24,5.74 4.24,7.62 4.7,8.08 5.32,8.08 R12.2 5.33,7.87
N$17
  Top 0.203: C28.1 13.59,16.43 11.68,16.43 R14.2 11.68,15.11 12.93,13.87 14.25,13.87 14.66,14.28 15.9,14.28 IC7.2
N$18
  Top 0.203: R15.2 C29.2 13.39,6.1 14.15,6.86 14.15,7.11 14.96,7.92 15.9,7.92 IC8.2
N$19  (via drill 0.25)
  Top 0.203: 19.76,27.08 IC4.5 | 19.76,27.08 18.72,27.08 v18.62,26.98 | 19.76,27.08 20.34,27.08 20.68,26.75 v20.68,26.19
  Bottom 0.203: R19.2 16,24.36 v18.62,26.98 | 24.13,26.57 R18.1 23.73,26.19 v20.68,26.19
N$20
  Top 0.203: C32.2 16.82,31.88 16.82,30.61 R21.2 16.87,30.53 16.87,29.36 18.41,27.81 18.47,27.74 | 18.47,27.74 17.3,26.57 14.86,26.57 14.12,27.3 14.12,28.47 13.79,28.8 13.22,28.8 R20.1 | 18.47,27.74 IC4.6
N$21
  Top 0.203: IC3.2 5.23,27.66 4.06,27.66 3.61,28.12 3.61,30.53 3.02,31.11 REF1.1
N$22  (via drill 0.25)
  Top 0.203: 22.84,10.31 v22.84,9.65 | 22.84,10.31 20.17,12.98 IC7.5 | 22.84,10.31 23.27,10.74 v23.85,10.74
  Bottom 0.203: R27.2 20.85,9.91 21.69,9.07 22.25,9.07 v22.84,9.65 | R26.1 22.61,14.73 23.85,13.49 v23.85,10.74
N$23  (via drill 0.25)
  Top 0.203: 19.58,20.04 19.58,20.55 19.76,20.73 IC5.5 | 19.58,20.04 v19.58,19.1 | 19.58,20.04 v20.52,20.04
  Bottom 0.203: 18.52,18.03 R23.2 18.53,18.01 19.2,18.01 19.58,18.39 v19.58,19.1 | R22.1 21.72,22.73 20.52,21.54 v20.52,20.04
N$24
  Top 0.203: R24.1 13.21,25.38 16.64,25.38 C33.2 16.79,25.4 R25.2 16.87,24.18 16.87,22.02 17.48,21.41 19.76,21.41 IC5.6
N$25
  Top 0.203: SIG1.1 3.73,27 IC3.3
N$26
  Top 0.203: R29.2 16.41,16.64 14.48,14.71 13.59,14.71 R28.1 | C34.2 17.2,17.91 17.2,16.71 R29.2 | IC7.6 20.14,13.66 19.07,13.66 17.2,15.54 17.2,16.54 R29.2
N$27
  Top 0.203: REF4.1 3.4,10.64 5.36,10.64 IC6.6
N$28  (via drill 0.25)
  Top 0.203: IC8.5 20.17,6.63 18.87,6.63 v18.8,6.71
  Bottom 0.203: R31.2 R30.1 | 24.05,6.96 R31.2 | v18.8,6.71 19.56,7.47 22.84,7.47 23.42,6.88 24.12,6.88 R31.2
N$29
  Top 0.203: R32.1 16.99,11.25 C35.2 17.17,11.3 R33.2 17.25,10.08 17.25,9.65 19.58,7.32 20.14,7.32 IC8.6
N$30
  Top 0.203: SIG4.1 1.09,7.92 1.09,9.86 2.54,11.3 IC6.5
N$31
  Top 0.203: R34.2 LED0.A
N$32
  Top 0.203: REF2.1 3.43,25.02 5.23,25.02 IC3.6
N$33
  Top 0.203: 5.36,13.28 IC6.2 5.26,13.28 4.09,13.28 3.56,13.82 3.56,15.24 REF3.1
N$34
  Top 0.203: SIG3.1 3.63,12.62 5.36,12.62 IC6.3
N$35
  Top 0.203: R35.2 LED1.A
N$36
  Top 0.203: R36.2 LED2.A
N$37
  Top 0.203: R37.2 LED3.A
N$38  (via drill 0.25)
  Top 0.203: v38.25,28.83 37.31,29.77 IC2.5
  Bottom 0.203: v38.25,28.83 38.99,28.83 JP6.1
N$40  (via drill 0.25)
  Top 0.254: v42.37,13.56 42.37,11 JP7.2
  Bottom 0.254: v42.37,13.56 48.34,19.53 49.02,19.53 X2.4
N$41
  Top 0.254: JP1.2 JP1.1 JP8.1
PA0  (via drill 0.25)
  Top 0.203: v25.12,14.5 23.44,16.18 23.44,17.25 23.85,17.65 23.85,17.73 IC1.17 | v26.14,11.89 26.14,4.22 v26.34,4.01
  Bottom 0.203: v25.12,14.5 26.14,13.49 v26.14,11.89 | JP2.2 v26.34,4.01
PA1  (via drill 0.25)
  Top 0.203: v25.27,17.8 24.71,17.8 24.31,17.4 24.23,17.4 IC1.18 | v30.15,10.57 30.15,2.74 JP2.3
  Bottom 0.203: v25.27,17.8 25.27,15.44 v30.15,10.57
PB0
  Top 0.203: LED0.C 38.1,17.02 37.29,16.2 36.5,16.2 36.04,16.66 IC1.45
PB1
  Top 0.203: LED1.C 38.91,18.41 37.11,16.61 36.8,16.61 36.4,17.02 IC1.46
PB2  (via drill 0.25)
  Top 0.203: LED2.C 39.78,19.81 v39.01,19.05 | v37.44,19.05 37.24,19.05 36.32,18.14 36.32,17.8 36.73,17.4 IC1.47
  Bottom 0.203: v37.44,19.05 v39.01,19.05
PB3
  Top 0.203: LED3.C 40.26,21.21 38.08,19.02 38.08,18.72 37.11,17.75 IC1.48
PB6  (via drill 0.25)
  Top 0.203: v31.45,26.29 31.01,26.29 30.4,25.68 29.18,25.68 IC1.1
  Bottom 0.203: v31.45,26.29 32.44,26.29 32.72,26.01 33.27,26.01 40.87,33.6 40.87,34.77 41.5,35.41 41.5,36.47 40.79,37.19 29.69,37.19 JP1.3
PB7  (via drill 0.25)
  Top 0.203: v27.2,25.5 28.09,24.61 IC1.4
  Bottom 0.203: v27.2,25.5 27.2,29.57 JP1.8
PC0
  Top 0.203: JP2.4 31.01,4.42 31.01,12.14 29.62,13.54 31.01,14.94 31.01,18.29 32.77,20.04 34.65,20.04 36.02,21.41 IC1.52
PC1  (via drill 0.25)
  Top 0.203: v38.56,20.42 37.49,21.49 36.88,21.49 36.47,21.08 36.4,21.08 IC1.51 | v39.65,15.72 39.65,14.91 38.96,14.22 38.96,10.74 v37.87,9.65 | v36.6,8.53 36.6,2.95 JP2.5
  Bottom 0.203: v38.56,20.42 39.65,19.33 v39.65,15.72 | v37.87,9.65 36.75,8.53 v36.6,8.53
PC2  (via drill 0.25)
  Top 0.203: v35.94,19.91 36.73,20.7 IC1.50
  Bottom 0.203: v35.94,19.91 35.94,17.68 39.14,14.48 39.14,13.23 38.89,12.98 38.25,12.98 37.69,12.42 37.69,11.86 39.22,10.34 39.65,10.34 40.41,9.58 40.41,6.96 42.14,5.23 42.14,1.63 41.43,0.91 39.6,0.91 JP2.6
PC3  (via drill 0.25)
  Top 0.203: v36.58,19.3 37.08,19.81 37.08,20.34 IC1.49 | v40.06,14.4 40.06,13.08 39.37,12.39 v39.37,9.7
  Bottom 0.203: v36.58,19.3 36.58,17.88 v40.06,14.4 | v39.37,9.7 39.37,8.05 39.65,7.77 39.65,3.4 JP2.7
PD0  (via drill 0.25)
  Top 0.203: v30.81,25.17 31.8,24.18 32.38,24.18 32.79,24.59 32.84,24.59 IC1.61 | v30.81,27.46 32.33,28.98 v32.33,30.18 | v36.25,30.35 36.25,29.49 v36.96,28.78 | v41.5,33.66 41.5,36.47 40.79,37.19 27.15,37.19 JP1.5
  Bottom 0.203: v30.81,27.46 v30.81,25.17 | v32.33,30.18 36.07,30.18 v36.25,30.35 | v36.96,28.78 36.96,29.11 v41.5,33.66
PD1  (via drill 0.25)
  Top 0.203: v34.09,24.84 33.55,25.38 32.99,25.38 32.59,24.97 32.51,24.97 IC1.62 | v32.56,23.32 32.38,23.32 27.18,18.11 26.62,18.11 v25.98,18.75 | v24.66,34.27 24.99,34.27 25.38,34.65 27.2,34.65 JP1.4
  Bottom 0.203: v32.56,23.32 v34.09,24.84 | v25.98,18.75 25.98,23.04 27.84,24.89 27.84,29.57 24.66,32.74 v24.66,34.27
PD2  (via drill 0.25)
  Top 0.203: v32.99,26.64 32.99,26.24 32.16,25.4 32.16,25.32 IC1.63
  Bottom 0.203: v32.99,26.64 32.99,28.6 29.69,31.9 29.69,33.93 28.93,34.7 25.15,34.7 23.9,35.94 JP1.7
PD3  (via drill 0.25)
  Top 0.203: v32.08,27.81 32.08,26.01 31.8,25.73 31.8,25.68 IC1.64
  Bottom 0.203: v32.08,27.81 32.08,27.89 26.57,33.4 JP1.6
PE0  (via drill 0.25)
  Top 0.203: CH4.1 22.1,6.53 20.7,7.92 20.17,7.92 IC8.7 20.07,8 19.56,8 18.95,8.61 18.95,10.08 R33.1 18.9,10.16 18.9,11.35 C35.1 18.36,11.94 v18.36,13.36 | v18.95,15.52 19.53,15.52 22.53,18.52 24.71,18.52 27.25,21.06 27.25,21.84 26.36,22.73 26.36,22.81 IC1.9
  Bottom 0.203: v18.95,15.52 18.36,14.94 v18.36,13.36
PE1  (via drill 0.25)
  Top 0.203: CH3.1 21.29,14.28 20.17,14.28 IC7.7 | v25.63,23.6 26.21,23.6 26.62,23.19 IC1.8 | v21.57,19.02 20.42,19.02 19.3,17.91 C34.1 18.9,17.83 18.9,16.64 R29.1 18.97,16.84 v19.94,16.84
  Bottom 0.203: v25.63,23.6 25.63,23.27 23.09,20.73 23.09,20.55 v21.57,19.02 | CH3.1 22.23,13.97 19.94,16.26 v19.94,16.84
PE2  (via drill 0.25)
  Top 0.203: R25.1 18.52,24.26 18.52,25.53 C33.1 | v25.78,24.46 26.06,24.46 26.98,23.55 27.03,23.55 IC1.7 | CH2.1 20.9,22.02 19.79,22.02 IC5.7 | 19.79,22.02 IC5.7 | 18.57,24.18 R25.1 | IC5.7 18.75,22.04 18.49,22.3 18.49,24.25 R25.1
  Bottom 0.203: v25.78,24.46 25.55,24.46 22.17,21.08 CH2.1
PE3  (via drill 0.25)
  Top 0.203: C32.1 18.52,31.88 18.52,30.61 R21.1 18.57,30.53 18.57,29.06 19.18,28.45 19.68,28.45 IC4.7 19.79,28.37 20.9,28.37 CH1.1 | v26.34,25.86 26.34,25.02 27.38,23.98 27.38,23.9 IC1.6
  Bottom 0.203: v26.34,25.86 24.77,27.43 CH1.1
PF0  (via drill 0.25)
  Top 0.203: v28.8,14.48 28.45,14.48 27.84,13.87 27.76,13.87 IC1.28 | v38.73,9.09 39.06,9.09 39.09,9.07 39.65,9.07 40.41,9.83 40.41,12.85 v42.44,14.88 | v47.5,22.23 v47.5,19.94
  Bottom 0.203: v28.8,14.48 32.49,14.48 33.73,13.23 35.97,13.23 37.29,11.91 37.29,11.15 38.73,9.7 v38.73,9.09 | v47.5,19.94 v42.44,14.88 | v47.5,22.23 47.78,22.23 48.39,22.84 49.02,22.84 X2.7
PF1  (via drill 0.25)
  Top 0.203: v27.2,12.6 28.09,13.49 IC1.29 | v39.01,7.49 39.62,7.49 41.17,9.04 42.19,9.04 44.83,11.68 v44.83,14.88
  Bottom 0.203: v27.2,12.6 28.45,11.35 28.45,10.79 27.69,10.16 27.69,7.29 28.37,6.68 38.2,6.68 v39.01,7.49 | v44.83,14.88 48.39,18.44 49.02,18.44 X2.3
PF2  (via drill 0.25)
  Top 0.203: v34.82,21.13 33.27,21.13 30.61,18.47 30.61,15.37 28.47,13.23 28.47,13.16 IC1.30
  Bottom 0.203: v34.82,21.13 48.54,21.13 49.02,20.65 X2.5
PF3
  Top 0.203: 28.73,12.78 28.8,12.78 IC1.31 27.81,11.79 27.2,11.79 26.9,11.48 26.9,1.63 26.19,0.91 23.34,0.91 JP3.1
  Bottom 0.203: JP3.1 23.75,0.51 41.6,0.51 43.43,2.34 43.43,9.58 43.71,9.86 43.71,12.68 48.39,17.35 49.02,17.35 X2.2
SIG2
  Top 0.203: SIG2.1 1.09,22.28 1.09,24.21 2.56,25.68 5.23,25.68 IC3.5
USBDM
  Top 0.203: IC1.43 35.33,15.95 35.41,15.95 35.79,15.57 36.07,15.57 36.3,15.8 37.47,15.8 38.02,16.36 40.34,16.36 41.17,15.52 45.16,15.52 46.86,17.22 46.86,27.51 47.47,28.12 47.47,31.17 46.91,31.73 X1.D-
USBDP  (via drill 0.25)
  Top 0.203: v34.72,17.27 35.66,16.33 IC1.44 | v41.53,26.72 41.53,28.52 44.37,31.37 44.37,31.9 44.86,32.38 X1.D+
  Bottom 0.203: v34.72,17.27 34.72,20.32 34.19,20.85 34.19,23.7 36.83,26.34 36.83,27.28 37.19,27.64 38.41,27.64 39.73,26.31 41.12,26.31 v41.53,26.72
VBUS  (via drill 0.25)
  Top 0.254: 40.84,31.67 39.93,31.67 IC2.3 | 40.84,31.67 41.38,31.67 42.04,32.33 42.16,32.33 C1.1 42.22,32.46 42.22,35.36 BATT.2 | 40.84,31.67 40.84,30.3 40.34,29.79 39.93,29.79 IC2.1 | v44.98,31.17 45.06,31.09 46.23,31.09 X1.VBUS
  Bottom 0.254: v44.98,31.17 44.98,33.76 BATT.2
VDDC  (via drill 0.25)
  Top 0.203: C12.1 24.26,13.56 24.56,13.87 25.58,13.87 26.62,14.91 IC1.25 26.72,15.01 29.52,17.8 v29.52,19.53 | C11.1 35.15,30.61 35.15,29.21 C10.1 35.15,29.13 35.15,27.76 C9.1 35.13,27.69 35.13,25.76 | 35.13,25.76 35.13,23.42 34.62,22.91 IC1.56 | v31.7,23.55 v29.26,21.11 | 35.13,25.76 v34.09,25.76
  Bottom 0.203: v29.52,19.53 29.52,20.85 v29.26,21.11 | v31.7,23.55 31.88,23.55 v34.09,25.76
VOA1  (via drill 0.25)
  Top 0.203: IC3.13 11.88,27.64 12.12,27.41 | 13.21,27.1 R20.2 13.19,27.08 12.45,27.08 12.12,27.41 | 9.5,30.73 R5.2 | v12.12,28.09 12.12,27.41 | 9.55,30.66 R5.2 | v11.1,29.11 9.98,29.11 9.47,29.62 9.47,30.72 R5.2 | R5.2 C19.2 11.42,31.95 R8.1
  Bottom 0.203: v11.1,29.11 v12.12,28.09
VOA2
  Top 0.203: 12.01,13.26 13.34,13.26 13.59,13.01 R28.2 | 12.01,13.26 IC6.13 | 9.37,16.26 R11.2 9.37,16.24 9.37,15.47 9.8,15.04 11.18,15.04 12.01,14.2 12.01,13.26 | 9.37,17.91 C26.2 9.45,17.96 9.6,18.11 R14.1
  Top 0.254: C26.2 R11.2
VOB1
  Top 0.203: 12.93,23.67 13.21,23.67 R24.2 13.19,23.65 12.57,23.65 12.09,24.13 | IC3.9 11.07,25.02 11.71,25.02 12.09,24.64 12.09,24.13 | R9.1 11.56,20.24 9.58,20.24 C20.1 R7.2 9.58,21.77 10.24,21.77 10.62,22.15 10.62,23.52 10.97,23.88 11.84,23.88 12.09,24.13
VOB2
  Top 0.203: IC6.9 11.2,10.64 11.79,10.64 12.86,9.56 R32.2 | 13.59,9.58 R32.2 | C27.1 R13.2 9.2,7.72 11.3,7.72 R15.1 11.1,7.8 11.2,7.8 11.38,7.98 11.38,8.38 11.66,8.66 13.26,8.66 13.56,8.97 13.56,9.54 R32.2
VREF  (via drill 0.25)
  Top 0.203: v15.95,9.91 16.84,9.02 16.84,7.67 16.48,7.32 15.93,7.32 IC8.3 | v15.95,11.89 16,11.89 16.84,12.72 16.84,13.26 16.46,13.64 IC7.3 | R17.2 23.82,30.1 22.99,30.94 R16.1 22.91,30.89 22.05,30.89 v21.89,30.73 | v14.91,24.66 16.46,23.11 16.46,21.77 16.1,21.41 15.54,21.41 IC5.3 | v16.69,27.2 16.61,27.2 16.08,27.74 IC4.3
  Bottom 0.203: v15.95,11.89 v15.95,9.91 15.9,9.83 15.9,7.04 15.06,6.2 14.5,6.2 12.06,8.64 12.06,9.6 10.62,11.05 8.05,11.05 4.7,14.4 4.7,23.93 7.06,26.29 14.02,26.29 14.83,25.48 14.91,25.43 | 14.91,25.43 v14.91,24.66 | 14.91,25.43 v16.69,27.2 16.76,27.25 20.24,30.73 v21.89,30.73

### Text on the board
tNames: GND | GND | + | CH1 | CH2 | CH3 | CH4 | RXD | TCK | TMS | BOOT | TXD | TDI | RESET | 3.3V | 3.3V | GND | TDO